# Altium schematic sheet Communication.SchDoc
size A4; SheetNumber: 4; SheetTotal: 5
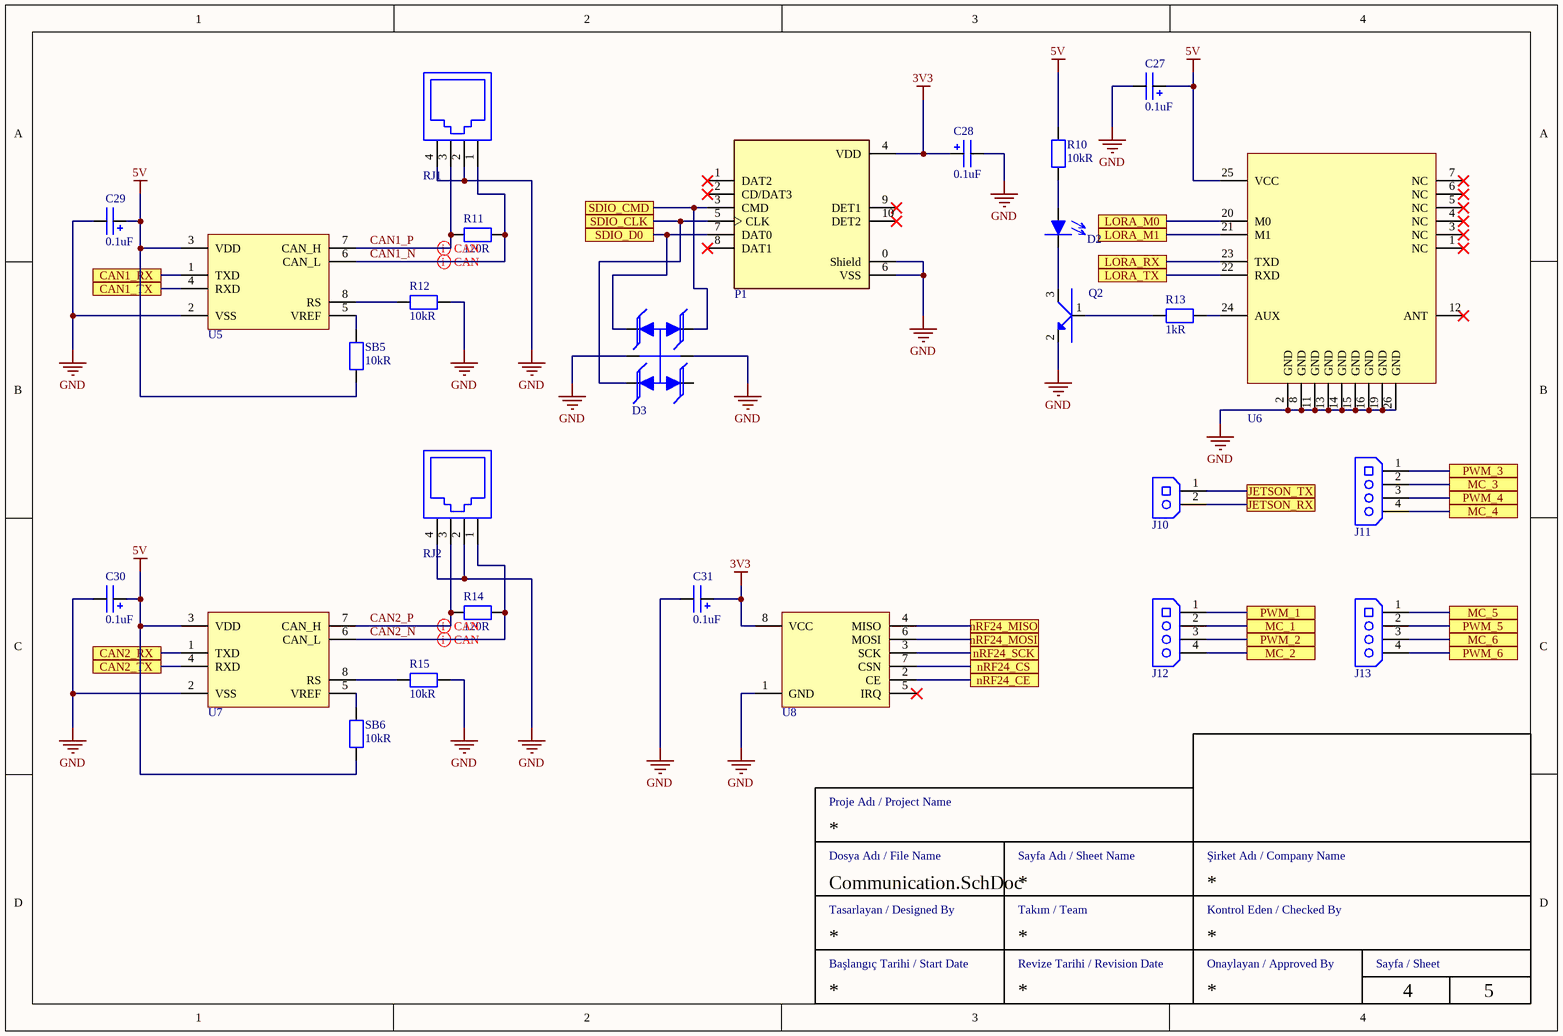
[diagram p0: Communication.SchDoc]

## Parts
C27  value 0.1uF  [CAP 0603]  (hidden comment: CAP 0603)
C28  value 0.1uF  [CAP 0603]  (hidden comment: CAP 0603)
C29  value 0.1uF  [CAP 0603]  (hidden comment: CAP 0603)
C30  value 0.1uF  [CAP 0603]  (hidden comment: CAP 0603)
C31  value 0.1uF  [CAP 0603]  (hidden comment: CAP 0603)
D2  LTW-C191TLA  [LED 0603]  (value not drawn)
D3  ESDA6V1SC6  [SOT23-6]  (value not drawn)
J10  JSTXH2  [JSTXH2]  (value not drawn)
J11  JSTXH4  [JSTXH4]  (value not drawn)
J12  JSTXH4  [JSTXH4]  (value not drawn)
J13  JSTXH4  [JSTXH4]  (value not drawn)
P1  DM3AT-SF-PEJM5  [SD CARD (8+2)]  (value not drawn)
Q2  BC817-40  [SOT23-3]  (value not drawn)
R10  value 10kR  [RESISTOR 0603]  (hidden comment: RES 0603)
R11  value 120R  [RESISTOR 0603]  (hidden comment: RES 0603)
R12  value 10kR  [RESISTOR 0603]  (hidden comment: RES 0603)
R13  value 1kR  [RESISTOR 0603]  (hidden comment: RES 0603)
R14  value 120R  [RESISTOR 0603]  (hidden comment: RES 0603)
R15  value 10kR  [RESISTOR 0603]  (hidden comment: RES 0603)
RJ1  DS1133-03-S60BX  [RJ6P4C]  (value not drawn)
RJ2  DS1133-03-S60BX  [RJ6P4C]  (value not drawn)
SB5  value 10kR  [RESISTOR 0603]  (hidden comment: RES 0603)
SB6  value 10kR  [RESISTOR 0603]  (hidden comment: RES 0603)
U5  MCP2551T-I  [SOIC-8]  (value not drawn)
U6  E220-400  [E220-400T22S]  (value not drawn)
U7  MCP2551T-I  [SOIC-8]  (value not drawn)
U8  NRF24  [nRF24L01+]  (value not drawn)

## Ports
CAN1_RX, CAN1_TX, CAN2_RX, CAN2_TX, JETSON_RX, JETSON_TX, LORA_M0, LORA_M1, LORA_RX, LORA_TX, MC_1, MC_2, MC_3, MC_4, MC_5, MC_6, nRF24_CE, nRF24_CS, nRF24_MISO, nRF24_MOSI, nRF24_SCK, PWM_1, PWM_2, PWM_3, PWM_4, PWM_5, PWM_6, SDIO_CLK, SDIO_CMD, SDIO_D0

## Nets
3V3: C28.1 C31.1 P1.4(VDD) U8.8(VCC)
5V: C27.1 C29.1 C30.1 R10.2 SB5.1 SB6.1 U5.3(VDD) U6.25(VCC) U7.3(VDD)
GND: C27.2 C28.2 C29.2 C30.2 C31.2 D3.2 D3.5 P1.0(Shield) P1.6(VSS) Q2.2(S) R12.2 R15.2 RJ1.2 RJ1.4 RJ2.2 RJ2.4 U5.2(VSS) U6.2(GND) U6.8(GND) U6.11(GND) U6.13(GND) U6.14(GND) U6.15(GND) U6.16(GND) U6.19(GND) U6.26(GND) U7.2(VSS) U8.1(GND)
CAN1_N: R11.1 RJ1.1 U5.6(CAN_L)
CAN1_P: R11.2 RJ1.3 U5.7(CAN_H)
CAN1_RX: U5.1(TXD) ; port CAN1_RX
CAN1_TX: U5.4(RXD) ; port CAN1_TX
CAN2_N: R14.1 RJ2.1 U7.6(CAN_L)
CAN2_P: R14.2 RJ2.3 U7.7(CAN_H)
CAN2_RX: U7.1(TXD) ; port CAN2_RX
CAN2_TX: U7.4(RXD) ; port CAN2_TX
JETSON_RX: J10.2 ; port JETSON_RX
JETSON_TX: J10.1 ; port JETSON_TX
LORA_M0: U6.20(M0) ; port LORA_M0
LORA_M1: U6.21(M1) ; port LORA_M1
LORA_RX: U6.23(TXD) ; port LORA_RX
LORA_TX: U6.22(RXD) ; port LORA_TX
MC_1: J12.2 ; port MC_1
MC_2: J12.4 ; port MC_2
MC_3: J11.2 ; port MC_3
MC_4: J11.4 ; port MC_4
MC_5: J13.1 ; port MC_5
MC_6: J13.3 ; port MC_6
nRF24_CE: U8.2(CE) ; port nRF24_CE
nRF24_CS: U8.7(CSN) ; port nRF24_CS
nRF24_MISO: U8.4(MISO) ; port nRF24_MISO
nRF24_MOSI: U8.6(MOSI) ; port nRF24_MOSI
nRF24_SCK: U8.3(SCK) ; port nRF24_SCK
PWM_1: J12.1 ; port PWM_1
PWM_2: J12.3 ; port PWM_2
PWM_3: J11.1 ; port PWM_3
PWM_4: J11.3 ; port PWM_4
PWM_5: J13.2 ; port PWM_5
PWM_6: J13.4 ; port PWM_6
SDIO_CLK: D3.6 P1.5(CLK) ; port SDIO_CLK
SDIO_CMD: D3.3 P1.3(CMD) ; port SDIO_CMD
SDIO_D0: D3.4 P1.7(DAT0) ; port SDIO_D0
NetD2_1: D2.1 Q2.3(D)
NetD2_2: D2.2 R10.1
NetQ2_1: Q2.1(G) R13.1
NetR12_1: R12.1 U5.8(RS)
NetR13_2: R13.2 U6.24(AUX)
NetR15_1: R15.1 U7.8(RS)
NetSB5_2: SB5.2 U5.5(VREF)
NetSB6_2: SB6.2 U7.5(VREF)

Not connected (* = marked no-connect by the designer): D3 1; P1 1(DAT2)* 2(CD/DAT3)* 8(DAT1)* 9(DET1)* 10(DET2)*; U6 1(NC)* 3(NC)* 4(NC)* 5(NC)* 6(NC)* 7(NC)* 12(ANT)*; U8 5(IRQ)*

## Layout directives
differential pair: CAN1_N, CAN1_P, CAN2_N, CAN2_P

## Notes on the sheet
- Dosya Adı / File Name
- Proje Adı / Project Name
- Sayfa Adı / Sheet Name
- Şirket Adı / Company Name
- Tasarlayan / Designed By
- Takım / Team
- Kontrol Eden / Checked By
- Başlangıç Tarihi / Start Date
- Revize Tarihi / Revision Date
- Onaylayan / Approved By
- Sayfa / Sheet

## Library data of the parts
C27-C31 = CAP 0603: Multilayer Ceramic Capacitor; Capacitor Type: MLCC; Case/Package: 0603
D2 = LED 0603: Chip LED; Case/Package: 0603
D3 = ESDA6V1SC6: Diode TVS Array; Voltage: 5.25V; Case/Package: SOT23; Diode Type: TVS Array
J10 = JSTXH2: JST Socket for PCB
J11-J13 = JSTXH4: JST Socket for PCB
P1 = DM3AT-SF-PEJM5: Micro SD Card Adapter
Q2 = BC817-40: Transistor BJT; Transistor Type: NPN; Voltage: 45V; Current: 500mA; Case/Package: SOT23
R10-R15 SB5 SB6 = RES 0603: SMD Chip Resistor; Case/Package: 0603
RJ1 RJ2 = RJ11: RJ11 Jack; Positions/Contacts: 6P/4C; RJ Type: RJ11
U5 U7 = MCP2551T-I: CAN Transceiver; Category: Interface IC; Case/Package: SOIC-8
U6 = E220-400: RF Transceiver; Frequency: 433MHz; Category: Wireless Comm
U8 = NRF24: RF Transceiver; Frequency: 2.4GHz; Category: Wireless Comm